# EAGLE design HuBreakout_rev_A_layer1 (EAGLE 9.6.2)
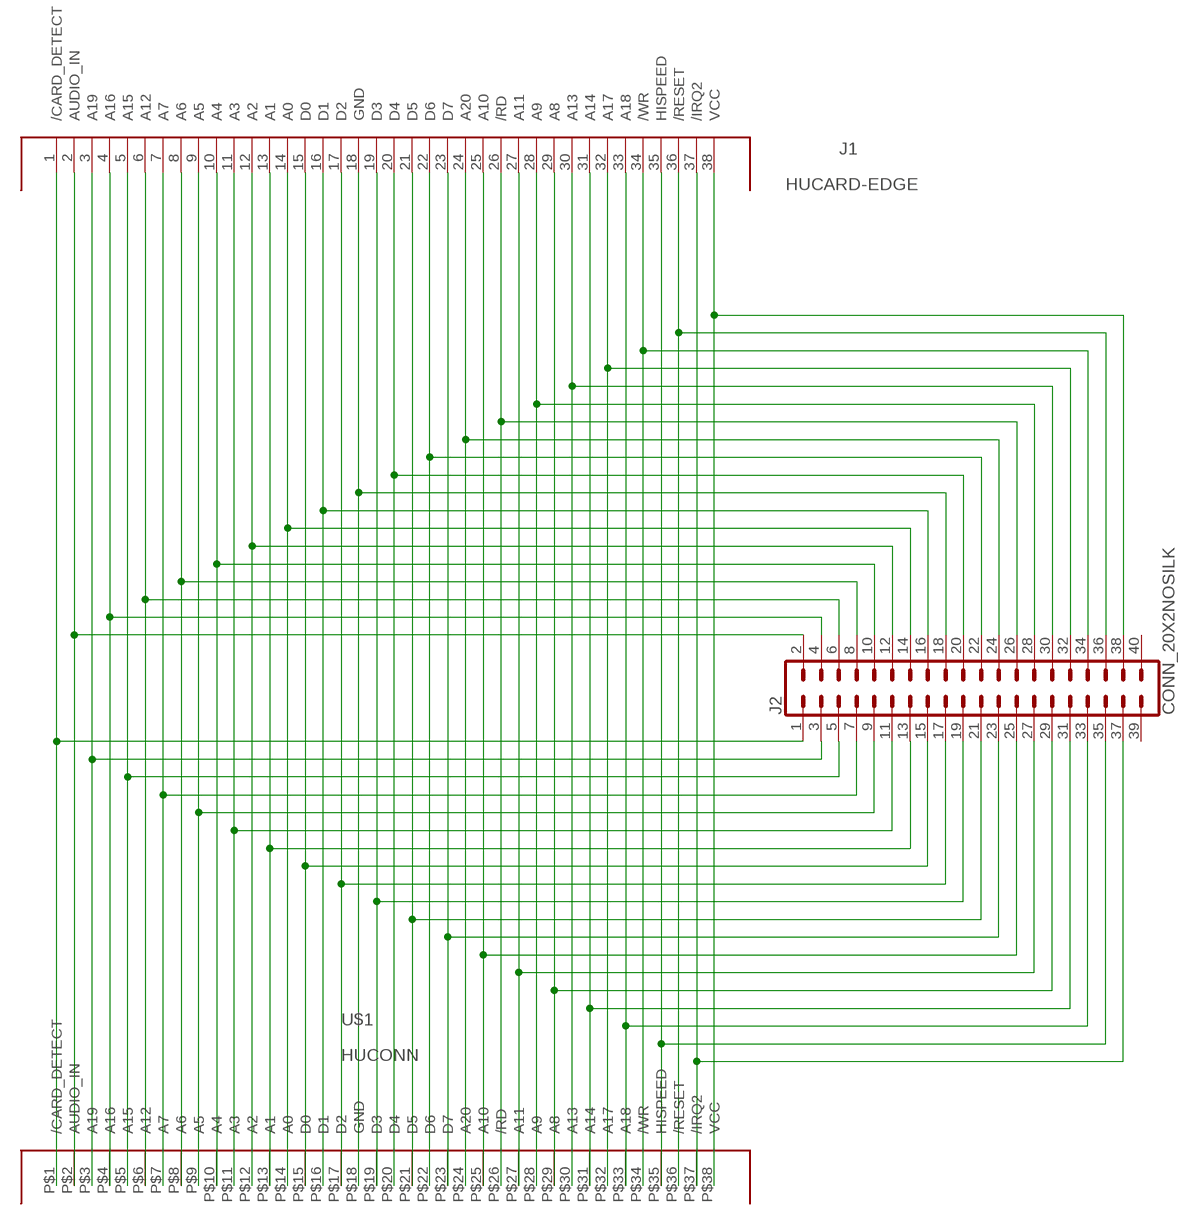
[diagram p0: schematic, sheet 1]

## Parts
J1  HUCARD-EDGE  [HUCARD-EDGE]
J2  CONN_20X2NOSILK  [2X20_NOSILK]
U$1  HUCONN  [HUCONN]

## Nets
GND: J1.18(GND) J2.18 U$1.P$18(GND)
N$1: J1.1(/CARD_DETECT) J2.1 U$1.P$1(/CARD_DETECT)
N$2: J1.2(AUDIO_IN) J2.2 U$1.P$2(AUDIO_IN)
N$3: J1.3(A19) J2.3 U$1.P$3(A19)
N$4: J1.4(A16) J2.4 U$1.P$4(A16)
N$5: J1.5(A15) J2.5 U$1.P$5(A15)
N$6: J1.6(A12) J2.6 U$1.P$6(A12)
N$7: J1.7(A7) J2.7 U$1.P$7(A7)
N$8: J1.8(A6) J2.8 U$1.P$8(A6)
N$9: J1.9(A5) J2.9 U$1.P$9(A5)
N$10: J1.10(A4) J2.10 U$1.P$10(A4)
N$11: J1.11(A3) J2.11 U$1.P$11(A3)
N$12: J1.12(A2) J2.12 U$1.P$12(A2)
N$15: J1.14(A0) J2.14 U$1.P$14(A0)
N$16: J1.15(D0) J2.15 U$1.P$15(D0)
N$17: J1.16(D1) J2.16 U$1.P$16(D1)
N$18: J1.17(D2) J2.17 U$1.P$17(D2)
N$19: J1.19(D3) J2.19 U$1.P$19(D3)
N$20: J1.20(D4) J2.20 U$1.P$20(D4)
N$21: J1.21(D5) J2.21 U$1.P$21(D5)
N$22: J1.22(D6) J2.22 U$1.P$22(D6)
N$23: J1.23(D7) J2.23 U$1.P$23(D7)
N$24: J1.24(A20) J2.24 U$1.P$24(A20)
N$25: J1.25(A10) J2.25 U$1.P$25(A10)
N$26: J1.26(/RD) J2.26 U$1.P$26(/RD)
N$27: J1.27(A11) J2.27 U$1.P$27(A11)
N$28: J1.28(A9) J2.28 U$1.P$28(A9)
N$29: J1.29(A8) J2.29 U$1.P$29(A8)
N$30: J1.30(A13) J2.30 U$1.P$30(A13)
N$31: J1.31(A14) J2.31 U$1.P$31(A14)
N$32: J1.32(A17) J2.32 U$1.P$32(A17)
N$33: J1.33(A18) J2.33 U$1.P$33(A18)
N$34: J1.34(/WR) J2.34 U$1.P$34(/WR)
N$35: J1.35(HISPEED) J2.35 U$1.P$35(HISPEED)
N$36: J1.36(/RESET) J2.36 U$1.P$36(/RESET)
N$37: J1.37(/IRQ2) J2.37 U$1.P$37(/IRQ2)
N$40: J1.13(A1) J2.13 U$1.P$13(A1)
VCC: J1.38(VCC) J2.38 U$1.P$38(VCC)
Unconnected: J2.39 J2.40

## Library data of the parts
J1 = PC-Engine:HUCARD-EDGE: This is a card-edge connector for PC Engine HuCards. The package origin identifies the corner of an un-mitered HuCard. There is a mask 'kepout' area at the edges to allow for artwork/soldermask at the edge
J2 = SparkFun-Connectors:CONN_20X2: Multi connection point. Often used as Generic Header-pin footprint for 0.1 inch spaced/style header connections On any of the 0.1 inch spaced packages, you can populate with these: Break Away Headers - Straight <https://www.sparkfun.com/products/116> (PRT-00116) Break Away Male Headers - Right Angle <https://www.sparkfun.com/products/553> (PRT-00553) Female Headers <https://www.sparkfun.com/products/115> (PRT-00115) Break Away Headers - Machine Pin <https://www.sparkfun.com/products/117> (PRT-00117) Break Away Female Headers - Swiss Machine Pin <https://www.sparkfun.com/products/743> (PRT-00743)
U$1 = PC-Engine:HUCONN

## Board
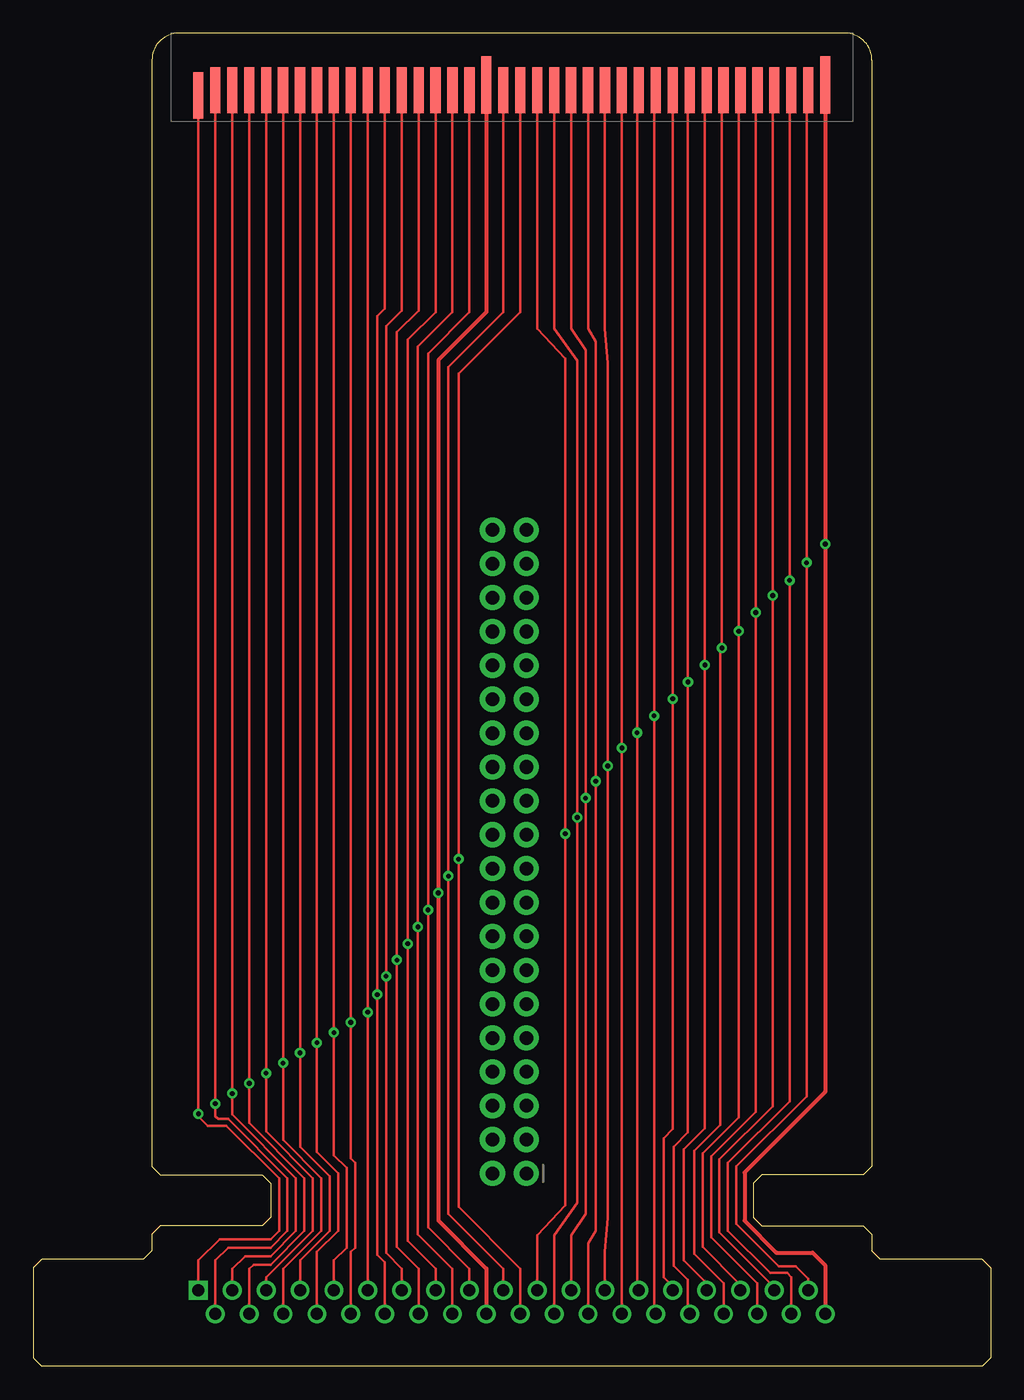
[diagram p1: board, top side]
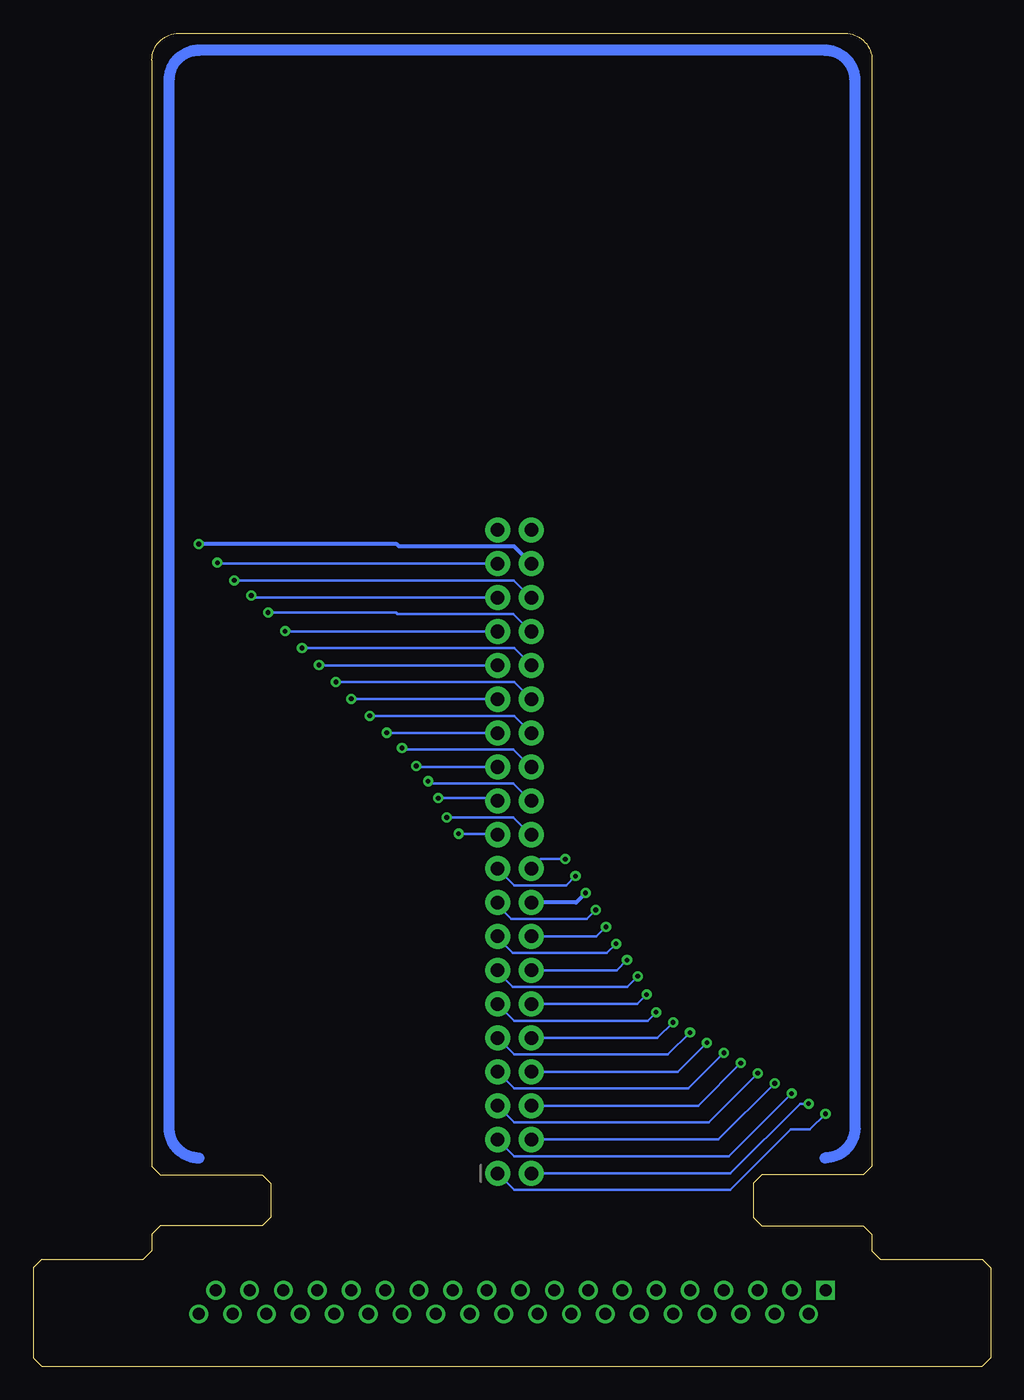
[diagram p2: board, bottom side, seen from below]

Size 71.75 x 99.95 mm. Coordinates in mm from the lower left corner, seen from the top.
Outline: 8.89,97.95 8.89,14.99 9.53,14.35 17.14,14.35 17.78,13.72 17.78,11.18 17.14,10.54 9.53,10.54 8.89,9.91 8.89,8.64 8.26,8 0.64,8 0,7.37 0,0.64 0.64,0 71.12,0 71.75,0.64 71.75,7.37 71.12,8 63.5,8 62.87,8.64 62.87,9.91 62.23,10.54 54.61,10.54 53.98,11.18 53.98,13.72 54.61,14.35 62.23,14.35 62.87,14.99 62.87,97.95 arc90 60.87,99.95 10.89,99.95 arc90 8.89,97.95
Copper layers (1*16): Top 0.035mm / dielectric 1.5mm / Bottom 0.035mm
Design rules "default *": minimum track width 6mil, minimum drill 0.35mm, track to track 6mil, track to pad 6mil, pad to pad 6mil, via to via 6mil, smd to smd 6mil, copper to edge 20mil, drill to drill 6mil, minimum pad ring 10mil, minimum via ring 8mil, stop-mask expansion 2mil, vias tented up to drill 15mil, thermal gap 10mil

### Footprints (pad centres in the part's own frame; a part is rotated, then mirrored left to right if it is on the bottom)
HUCARD-EDGE = smd 0.762 x 3.48: 1 3.48,-4.674; 2 4.75,-4.267; 3 6.02,-4.267; 4 7.29,-4.267; 5 8.56,-4.267; 6 9.83,-4.267; 7 11.1,-4.267; 8 12.37,-4.267; 9 13.64,-4.267; 10 14.91,-4.267; 11 16.18,-4.267; 12 17.45,-4.267; 13 18.72,-4.267; 14 19.99,-4.267; 15 21.26,-4.267; 16 22.53,-4.267; 17 23.8,-4.267; 19 26.34,-4.267; 20 27.61,-4.267; 21 28.88,-4.267; 22 30.15,-4.267; 23 31.42,-4.267; 24 32.69,-4.267; 25 33.96,-4.267; 26 35.23,-4.267; 27 36.5,-4.267; 28 37.77,-4.267; 29 39.04,-4.267; 30 40.31,-4.267; 31 41.58,-4.267; 32 42.85,-4.267; 33 44.12,-4.267; 34 45.39,-4.267; 35 46.66,-4.267; 36 47.93,-4.267; 37 49.2,-4.267 | smd 0.762 x 4.318: 18 25.07,-3.861; 38 50.47,-3.861
2X20_NOSILK = drill 1.016 pad 1.88: 1 0,0; 2 0,2.54; 3 2.54,0; 4 2.54,2.54; 5 5.08,0; 6 5.08,2.54; 7 7.62,0; 8 7.62,2.54; 9 10.16,0; 10 10.16,2.54; 11 12.7,0; 12 12.7,2.54; 13 15.24,0; 14 15.24,2.54; 15 17.78,0; 16 17.78,2.54; 17 20.32,0; 18 20.32,2.54; 19 22.86,0; 20 22.86,2.54; 21 25.4,0; 22 25.4,2.54; 23 27.94,0; 24 27.94,2.54; 25 30.48,0; 26 30.48,2.54; 27 33.02,0; 28 33.02,2.54; 29 35.56,0; 30 35.56,2.54; 31 38.1,0; 32 38.1,2.54; 33 40.64,0; 34 40.64,2.54; 35 43.18,0; 36 43.18,2.54; 37 45.72,0; 38 45.72,2.54; 39 48.26,0; 40 48.26,2.54
HUCONN = drill 0.9 square: P$1 1.27,0 | drill 0.9: P$2 2.54,-1.778; P$3 3.81,0; P$4 5.08,-1.778; P$5 6.35,0; P$6 7.62,-1.778; P$7 8.89,0; P$8 10.16,-1.778; P$9 11.43,0; P$10 12.7,-1.778; P$11 13.97,0; P$12 15.24,-1.778; P$13 16.51,0; P$14 17.78,-1.778; P$15 19.05,0; P$16 20.32,-1.778; P$17 21.59,0; P$18 22.86,-1.778; P$19 24.13,0; P$20 25.4,-1.778; P$21 26.67,0; P$22 27.94,-1.778; P$23 29.21,0; P$24 30.48,-1.778; P$25 31.75,0; P$26 33.02,-1.778; P$27 34.29,0; P$28 35.56,-1.778; P$29 36.83,0; P$30 38.1,-1.778; P$31 39.37,0; P$32 40.64,-1.778; P$33 41.91,0; P$34 43.18,-1.778; P$35 44.45,0; P$36 45.72,-1.778; P$37 46.99,0; P$38 48.26,-1.778

### Placement (x,y rotation side)
J1  8.89,99.95 0 top
J2  36.96,14.45 90 top
U$1  11.1,5.69 0 top

### Tracks (layer width: path | path; a pad name or v marks a point on that pad's centre or on a via)
GND  (via drill 0.35)
  Top 0.305: J1.18 33.96,79.05 30.35,75.44 v30.35,35.48 30.35,10.92 33.96,7.32 U$1.P$18
  Bottom 0.305: v30.35,35.48 31.06,34.77 J2.18
N$1  (via drill 0.35)
  Top 0.203: J1.1 v12.37,18.92 12.37,18.75 13.08,18.03 14.48,18.03 18.41,14.1 18.41,10.16 17.78,9.53 13.97,9.53 12.37,7.92 U$1.P$1
  Bottom 0.203: v12.37,18.92 13.54,17.75 14.98,17.75 19.53,13.21 35.71,13.21 J2.1
N$2  (via drill 0.35)
  Top 0.203: J1.2 v13.64,19.68 13.64,18.75 13.84,18.54 14.61,18.54 19.05,14.1 19.05,10.16 17.78,8.89 14.61,8.89 13.64,7.92 U$1.P$2
  Bottom 0.203: v13.64,19.68 14.28,19.68 19.51,14.45 J2.2
N$3  (via drill 0.35)
  Top 0.203: J1.3 v14.91,20.45 14.91,18.87 19.68,14.1 19.68,10.16 17.78,8.26 15.88,8.26 14.91,7.29 U$1.P$3
  Bottom 0.203: v14.91,20.45 19.61,15.75 35.71,15.75 J2.3
N$4  (via drill 0.35)
  Top 0.203: J1.4 v16.18,21.21 16.18,18.24 20.32,14.1 20.32,10.16 17.78,7.62 16.51,7.62 16.18,7.29 U$1.P$4
  Bottom 0.203: v16.18,21.21 20.4,16.99 J2.4
N$5  (via drill 0.35)
  Top 0.203: J1.5 v17.45,21.97 17.45,17.6 20.95,14.1 20.95,10.16 17.45,6.66 U$1.P$5
  Bottom 0.203: v17.45,21.97 21.13,18.29 35.71,18.29 J2.5
N$6  (via drill 0.35)
  Top 0.203: J1.6 v18.72,22.73 18.72,16.97 21.59,14.1 21.59,10.16 18.72,7.29 U$1.P$6
  Bottom 0.203: v18.72,22.73 21.92,19.53 J2.6
N$7  (via drill 0.35)
  Top 0.203: J1.7 v19.99,23.5 19.99,16.46 22.23,14.22 22.23,10.16 19.99,7.92 U$1.P$7
  Bottom 0.203: v19.99,23.5 22.66,20.83 35.71,20.83 J2.7
N$8  (via drill 0.35)
  Top 0.203: U$1.P$8 21.26,8.56 22.86,10.16 22.86,14.48 21.26,16.08 v21.26,24.26 J1.8
  Bottom 0.203: v21.26,24.26 23.44,22.07 J2.8
N$9  (via drill 0.35)
  Top 0.203: J1.9 v22.53,25.02 22.53,15.82 23.5,14.86 23.5,8.89 22.53,7.92 U$1.P$9
  Bottom 0.203: v22.53,25.02 24.18,23.37 35.71,23.37 J2.9
N$10  (via drill 0.35)
  Top 0.203: J1.10 v23.8,25.78 23.8,15.57 24.13,15.24 24.13,8.89 23.8,8.56 U$1.P$10
  Bottom 0.203: v23.8,25.78 24.97,24.61 J2.10
N$11  (via drill 0.35)
  Top 0.203: J1.11 v25.07,26.54 U$1.P$11
  Bottom 0.203: v25.07,26.54 25.7,25.91 35.71,25.91 J2.11
N$12  (via drill 0.35)
  Top 0.203: U$1.P$12 26.34,7.8 25.78,8.36 v25.78,27.86 25.78,78.74 26.34,79.3 J1.12
  Bottom 0.203: v25.78,27.86 26.49,27.15 J2.12
N$13
  Bottom 0.813: 10.16,96.42 arc-90 12.41,98.68 | 12.41,98.68 59.34,98.68 arc-90 61.59,96.42 61.59,17.9 arc-90 59.34,15.62 | 10.16,17.95 10.16,96.42 | 10.16,96.42 10.16,96.48 | 10.16,96.42 arc-90 12.41,98.68
N$14
  Bottom 0.813: 10.16,17.9 arc90 12.41,15.62
N$15  (via drill 0.35)
  Top 0.203: U$1.P$14 28.88,7.32 27.25,8.94 v27.25,30.45 27.25,77.55 28.88,79.17 J1.14
  Bottom 0.203: v27.25,30.45 28.02,29.69 J2.14
N$16  (via drill 0.35)
  Top 0.203: J1.15 30.15,79.05 28.07,76.96 v28.07,31.67 28.07,9.4 30.15,7.32 U$1.P$15
  Bottom 0.203: v28.07,31.67 28.75,30.99 35.81,30.99 36.96,32.13 J2.15
N$17  (via drill 0.35)
  Top 0.203: J1.16 31.42,79.05 28.83,76.45 v28.83,32.94 28.83,9.91 31.42,7.32 U$1.P$16
  Bottom 0.203: v28.83,32.94 29.54,32.23 J2.16
N$18  (via drill 0.35)
  Top 0.203: J1.17 32.69,79.05 29.59,75.95 v29.59,34.21 29.59,10.41 32.69,7.32 U$1.P$17
  Bottom 0.203: v29.59,34.21 30.28,33.53 35.94,33.53 36.96,34.54 J2.17
N$19  (via drill 0.35)
  Top 0.203: J1.19 35.23,79.05 31.11,74.93 v31.11,36.75 31.11,11.43 35.23,7.32 U$1.P$19
  Bottom 0.203: v31.11,36.75 31.8,36.07 35.71,36.07 J2.19
N$20  (via drill 0.35)
  Top 0.203: J1.20 36.5,79.05 31.88,74.42 v31.88,38.02 31.88,11.94 36.5,7.32 U$1.P$20
  Bottom 0.203: v31.88,38.02 33.71,38.02 J2.20
N$21  (via drill 0.35)
  Top 0.203: J1.21 37.77,77.8 39.88,75.56 v39.88,39.93 39.88,12.06 37.77,9.83 U$1.P$21
  Bottom 0.203: v39.88,39.93 37.03,39.93 J2.21
N$22  (via drill 0.35)
  Top 0.203: J1.22 39.04,77.8 40.77,75.39 v40.77,41.15 40.77,12.24 39.04,9.83 U$1.P$22
  Bottom 0.203: v40.77,41.15 35.76,41.15 J2.22
N$23  (via drill 0.35)
  Top 0.203: J1.23 40.31,77.8 41.4,76.2 v41.4,42.6 41.4,11.43 40.31,9.83 U$1.P$23
  Bottom 0.203: v41.4,42.6 37.16,42.6 J2.23
N$24  (via drill 0.35)
  Top 0.203: J1.24 41.58,77.8 42.16,76.83 v42.16,43.87 42.16,10.16 41.58,9.2 U$1.P$24
  Bottom 0.203: v42.16,43.87 42.11,43.87 41.99,43.69 35.76,43.69 J2.24
N$25  (via drill 0.35)
  Top 0.203: J1.25 42.85,77.8 43.05,75.23 v43.05,45.01 43.05,11.13 42.85,8.56 U$1.P$25
  Bottom 0.203: J2.25 42.98,44.93 v43.05,45.01
N$26  (via drill 0.35)
  Top 0.203: U$1.P$26 v44.12,46.35 J1.26
  Bottom 0.203: v44.12,46.35 44.08,46.35 44.01,46.23 35.76,46.23 J2.26
N$27  (via drill 0.35)
  Top 0.203: J1.27 45.26,95.56 v45.26,47.5 45.26,5.82 U$1.P$27
  Bottom 0.203: J2.27 45.24,47.47 v45.26,47.5
N$28  (via drill 0.35)
  Top 0.203: J1.28 46.53,95.56 v46.53,48.77 46.53,4.04 U$1.P$28
  Bottom 0.203: J2.28 35.71,48.77 v46.53,48.77
N$29  (via drill 0.35)
  Top 0.203: J1.29 v47.93,50.04 47.93,17.78 47.24,17.09 47.24,6.66 47.93,5.97 U$1.P$29
  Bottom 0.203: J2.29 47.9,50.01 v47.93,50.04
N$30  (via drill 0.35)
  Top 0.203: J1.30 49.07,95.56 v49.07,51.31 49.07,17.53 48.01,16.46 48.01,7.54 49.07,6.48 49.07,4.04 U$1.P$30
  Bottom 0.203: J2.30 35.71,51.31 v49.07,51.31
N$31  (via drill 0.35)
  Top 0.203: J1.31 50.34,95.56 v50.34,52.58 50.34,17.83 48.77,16.26 48.77,7.92 50.34,6.35 50.34,5.82 U$1.P$31
  Bottom 0.203: J2.31 50.32,52.55 v50.34,52.58
N$32  (via drill 0.35)
  Top 0.203: J1.32 51.61,95.56 v51.61,53.85 51.49,53.72 51.49,18.09 49.53,16.13 49.53,8.43 51.74,6.22 U$1.P$32
  Bottom 0.203: J2.32 35.71,53.85 v51.61,53.85
N$33  (via drill 0.35)
  Top 0.203: J1.33 52.88,95.56 v52.88,55.12 52.88,18.67 50.16,15.95 50.16,8.94 52.88,6.22 52.88,5.82 U$1.P$33
  Bottom 0.203: J2.33 52.86,55.09 v52.88,55.12
N$34  (via drill 0.35)
  Top 0.203: J1.34 54.15,95.56 v54.15,56.52 54.15,19.07 50.83,15.75 50.83,9.65 54.28,6.2 U$1.P$34
  Bottom 0.203: v54.15,56.52 44.54,56.52 44.46,56.39 35.76,56.39 J2.34
N$35  (via drill 0.35)
  Top 0.203: J1.35 55.42,95.56 v55.42,57.78 55.42,19.48 51.44,15.49 51.44,10.03 55.55,5.92 U$1.P$35
  Bottom 0.203: J2.35 55.27,57.63 v55.42,57.78
N$36  (via drill 0.35)
  Top 0.203: J1.36 56.69,95.56 v56.69,58.93 56.69,19.86 52.07,15.24 52.07,10.16 55.24,6.99 56.52,6.99 56.82,6.68 U$1.P$36
  Bottom 0.203: J2.36 35.74,58.93 v56.69,58.93
N$37  (via drill 0.35)
  Top 0.203: J1.37 57.96,95.56 v57.96,60.25 57.96,20.24 52.7,14.99 52.7,10.69 55.89,7.51 57.14,7.51 58.09,6.55 U$1.P$37
  Bottom 0.203: J2.37 57.89,60.17 v57.96,60.25
N$40  (via drill 0.35)
  Top 0.203: J1.13 27.61,79.17 26.44,78 v26.44,29.23 26.44,8.48 27.61,7.32 U$1.P$13
  Bottom 0.203: v26.44,29.23 27.23,28.45 35.81,28.45 36.96,29.59 J2.13
VCC  (via drill 0.35)
  Top 0.305: J1.38 v59.36,61.65 59.36,20.57 53.31,14.53 53.31,10.9 55.71,8.51 58.42,8.51 59.36,7.57 U$1.P$38
  Bottom 0.305: v59.36,61.65 44.51,61.65 44.33,61.47 35.71,61.47 J2.38

### Text on the board
tValues: NC :40 | 39: NC | +5V :38 | 37: /IRQ2 | /RESET :36 | 35: HiSpeed | /WR :34 | 33: A18 | A17 :32 | 31: A14 | A13 :30 | 29: A8 | A9 :28 | 27: A11 | /OE :26 | 25: A10 | A20 :24 | 23: D7 | D6: 22 | 21: D5 | D4 :20 | 19: D3 | GND :18 | 17: D2 | D1 :16 | 15: D0 | HuCard / Breakout | A0 :14 | 13: A1 | Board Ver. A | A2 :12 | 11: A3 | A4 :10 | 9: A5 | A6 :8 | 7: A7 | Prototype by / David Shadoff / (c) 2021 | A12 :6 | 5: A15 | A16 :4 | 3: A19 | Audio_In :2 | 1: Card Detect